# Altium schematic sheet Controlador de corriente  V3.SchDoc: Levitador magnético
size A4
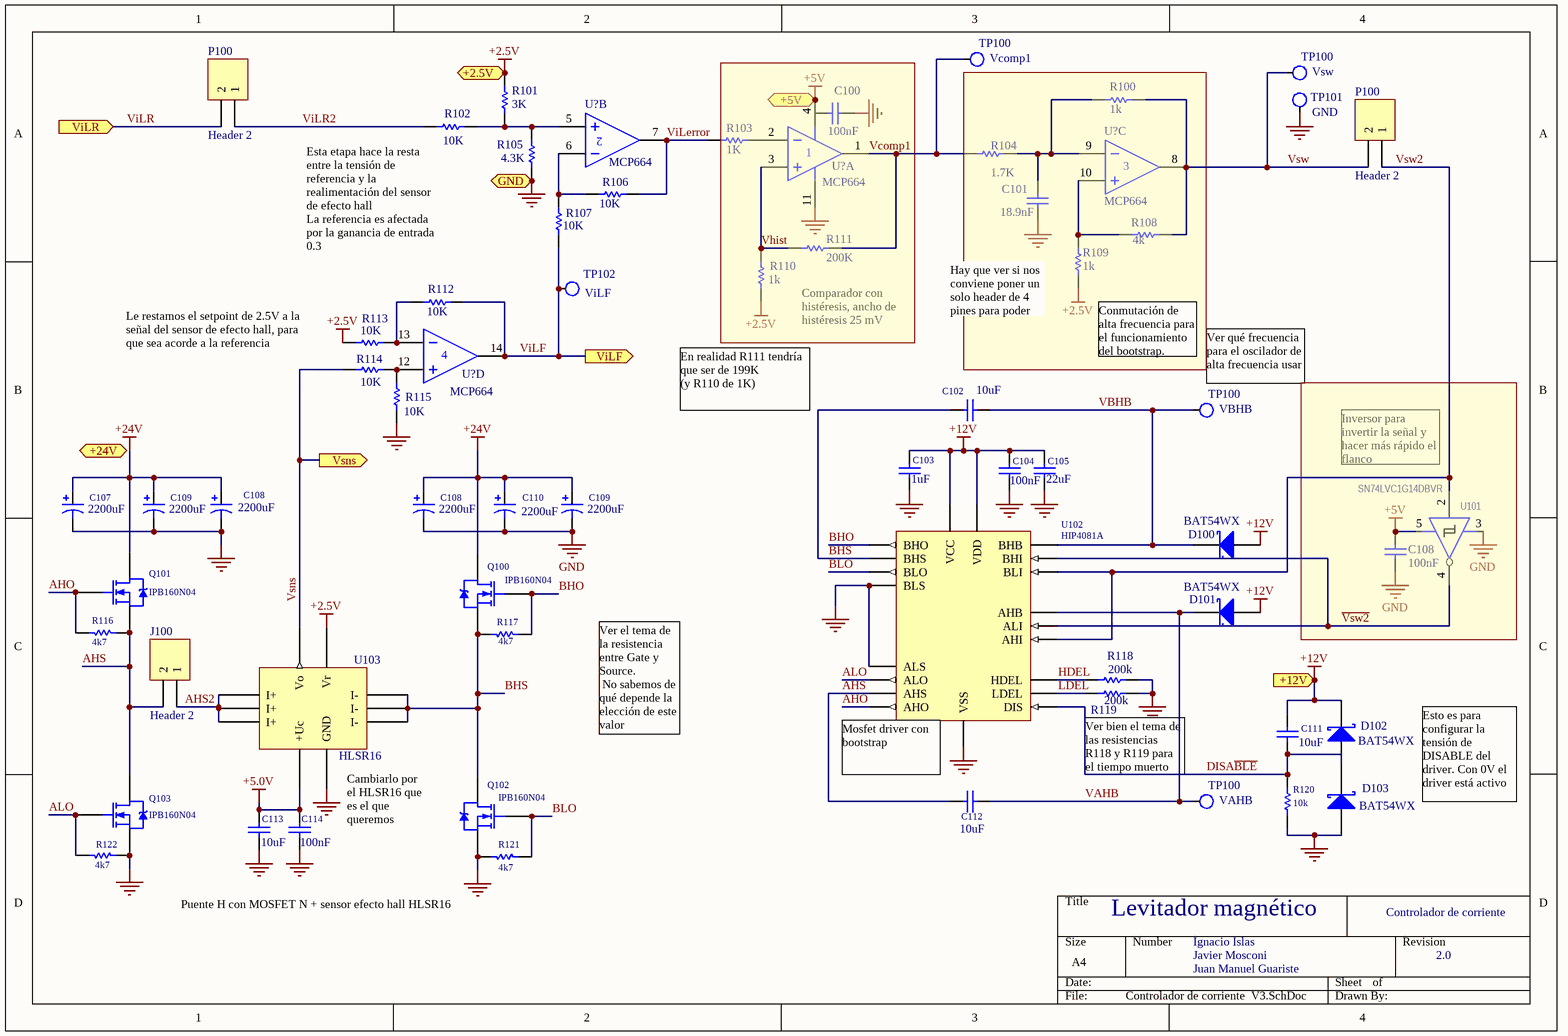
[diagram p0: Controlador de corriente  V3.SchDoc]

## Parts
(Parts that share a designator on the sheet are numbered #1, #2 ... from top to bottom, then left to right.)
C100  value 100nF  [C1206]  (hidden comment: Cap)
C101  value 18.9nF  [C1206]  (hidden comment: Cap)
C102  10uF  [C1206]
C103  1uF  [C1206]
C104  100nF  [C1206]
C105  22uF  [C1206]
C107  value 2200uF  [ALU CASE P]  (hidden comment: Cap Pol1)
C108#1  value 2200uF  [ALU CASE P]  (hidden comment: Cap Pol1)
C108#2  value 2200uF  [ALU CASE P]  (hidden comment: Cap Pol1)
C108#3  value 100nF  [C1206]  (hidden comment: Cap)
C109#1  value 2200uF  [ALU CASE P]  (hidden comment: Cap Pol1)
C109#2  value 2200uF  [ALU CASE P]  (hidden comment: Cap Pol1)
C110  value 2200uF  [ALU CASE P]  (hidden comment: Cap Pol1)
C111  10uF  [C1206]
C112  10uF  [C1206]
C113  10uF  [C1206]
C114  100nF  [C1206]
D100  BAT54WX  [SOD523]
D101  BAT54WX  [SOD523]
D102  BAT54WX  [SOD523]
D103  BAT54WX  [SOD523]
J100  Header 2  [SMKDS5-2-9.5]
P100#1  Header 2  [HDR1X2]
P100#2  Header 2  [HDR1X2]
Q100  IPB160N04  [TO263-7S]
Q101  IPB160N04  [TO263-7S]
Q102  IPB160N04  [TO263-7S]
Q103  IPB160N04  [TO263-7S]
R100  value 1k  [R 1206L]  (hidden comment: Res1)
R101  value 3K  [R 1206L]  (hidden comment: Res1)
R102  value 10K  [R 1206L]  (hidden comment: Res1)
R103  value 1K  [R 1206L]  (hidden comment: Res1)
R104  value 1.7K  [R 1206L]  (hidden comment: Res1)
R105  value 4.3K  [R 1206L]  (hidden comment: Res1)
R106  value 10K  [R 1206L]  (hidden comment: Res1)
R107  value 10K  [R 1206L]  (hidden comment: Res1)
R108  value 4k  [R 1206L]  (hidden comment: Res1)
R109  value 1k  [R 1206L]  (hidden comment: Res1)
R110  value 1k  [R 1206L]  (hidden comment: Res1)
R111  value 200K  [R 1206L]  (hidden comment: Res1)
R112  value 10K  [R 1206L]  (hidden comment: Res1)
R113  value 10K  [R 1206L]  (hidden comment: Res1)
R114  value 10K  [R 1206L]  (hidden comment: Res1)
R115  value 10K  [R 1206L]  (hidden comment: Res1)
R116  4k7  [R 1206L]
R117  4k7  [R 1206L]
R118  value 200k  [R 1206L]  (hidden comment: Res1)
R119  value 200k  [R 1206L]  (hidden comment: Res1)
R120  10k  [R 1206L]
R121  4k7  [R 1206L]
R122  4k7  [R 1206L]
TP100#1  Vcomp1  [TestPoint Keystone 5000 Silver-Red]
TP100#2  Vsw  [TestPoint Keystone 5000 Silver-Red]
TP100#3  VBHB  [TestPoint Keystone 5000 Silver-Red]
TP100#4  VAHB  [TestPoint Keystone 5000 Silver-Red]
TP101  GND  [TestPoint Keystone 5000 Silver-Red]
TP102  ViLF  [TestPoint Keystone 5000 Silver-Red]
U101  SN74LVC1G14DBVR  [SOT23-5]
U102  HIP4081A  [SOIC20]
U103  HLSR16  [HSLR-P]
U?#1  MCP664  (part B of 4)
U?#2  MCP664  (part A of 4)
U?#3  MCP664  (part C of 4)
U?#4  MCP664  (part D of 4)

## Ports
+2.5V (in), +5V (in), +12V (in), +24V (in), GND (in), ViLF (out), ViLR (in), Vsns (out)

## Nets
+2.5V: R101.2 R109.1 R110.1 R113.1 U103.1(Vr) ; port +2.5V
+5.0V: C113.2 C114.2 U103.4(+Uc)
+5V: C108#3.1 U101.5(V+) U?#2.4(V+) ; port +5V
+12V: C103.2 C104.2 C105.2 C111.1 D100.1(A) D101.1(A) D102.2(K) U102.15(VCC) U102.16(VDD) ; port +12V
+24V: C107.1 C108#1.1 C108#2.1 C109#1.1 C109#2.1 C110.1 Q100.4(D) Q101.4(D)
GND: C100.2 C101.1 C103.1 C104.1 C105.1 C107.2 C108#1.2 C108#2.2 C108#3.2 C109#1.2 C109#2.2 C110.2 C113.1 C114.1 D103.1(A) Q102.2(S) Q102.3(S) Q102.5(S) Q102.6(S) Q102.7(S) Q103.2(S) Q103.3(S) Q103.5(S) Q103.6(S) Q103.7(S) R105.2 R115.1 R118.2 R119.2 R120.2 R121.2 R122.1 TP101.1 U101.3(V-) U102.4(VSS) U102.14(ALS) U102.17(BLS) U103.3(GND) U?#2.11(V-) ; port GND
AHO: Q101.1(G) R116.2 U102.11(AHO)
AHS: C112.1 J100.2 Q101.2(S) Q101.3(S) Q101.5(S) Q101.6(S) Q101.7(S) Q103.4(D) R116.1 U102.12(AHS)
AHS2: J100.1 U103.8(I+) U103.9(I+) U103.10(I+)
ALO: Q103.1(G) R122.2 U102.13(ALO)
BHO: Q100.1(G) R117.1 U102.20(BHO)
BHS: C102.2 Q100.2(S) Q100.3(S) Q100.5(S) Q100.6(S) Q100.7(S) Q102.4(D) R117.2 U102.19(BHS) U103.5(I-) U103.6(I-) U103.7(I-)
BLO: Q102.1(G) R121.1 U102.18(BLO)
DISA~{BLE}: C111.2 R120.1 U102.3(DIS)
HDEL: R118.1 U102.8(HDEL)
LDEL: R119.1 U102.9(LDEL)
~{Vsw2}: U101.4(Y) U102.2(BHI) U102.6(ALI)
VAHB: C112.2 D101.2(K) TP100#4.1 U102.10(AHB)
VBHB: C102.1 D100.2(K) TP100#3.1 U102.1(BHB)
Vcomp1: R104.1 R111.2 TP100#1.1 U?#2.1(OUT)
Vhist: R110.2 R111.1 U?#2.3(IN+)
ViLerror: R103.1 R106.2 U?#1.7(OUT)
ViLF: R107.1 R112.2 TP102.1 U?#4.14(OUT) ; port ViLF
ViLR: P100#1.2 ; port ViLR
ViLR2: P100#1.1 R102.1
Vsns: R114.1 U103.2(Vo) ; port Vsns
Vsw: P100#2.2 R100.2 R108.2 TP100#2.1 U?#3.8(OUT)
Vsw2: P100#2.1 U101.2(A) U102.5(BLI) U102.7(AHI)
NetC101_2: C101.2 R100.1 R104.2 U?#3.9(IN-)
NetD102_1: D102.1(A) D103.2(K)
NetR101_1: R101.1 R102.2 R105.1 U?#1.5(IN+)
NetR103_2: R103.2 U?#2.2(IN-)
NetR106_1: R106.1 R107.2 U?#1.6(IN-)
NetR108_1: R108.1 R109.2 U?#3.10(IN+)
NetR112_1: R112.1 R113.2 U?#4.13(IN-)
NetR114_2: R114.2 R115.2 U?#4.12(IN+)

Not connected (* = marked no-connect by the designer): C100 1

## Notes on the sheet
- (near R102) Esta etapa hace la resta entre la tensión de referencia y la realimentación del sensor de efecto hall
  La referencia es afectada por la ganancia de entrada 0.3
- Hay que ver si nos conviene poner un solo header de 4 pines para poder puentear el oscilador de alta frecuencia
- Le restamos el setpoint de 2.5V a la señal del sensor de efecto hall, para que sea acorde a la referencia
- Comparador con histéresis, ancho de histéresis 25 mV
- Conmutación de alta frecuencia para el funcionamiento del bootstrap.
  Frecuencia a determinar >= 20 kHz (ponele)
- (near TP100#3) Ver qué frecuencia para el oscilador de alta frecuencia usar
- En realidad R111 tendría que ser de 199K
  (y R110 de 1K)
- Inversor para invertir la señal y hacer más rápido el flanco
- Ver el tema de la resistencia entre Gate y Source.
  No sabemos de qué depende la elección de este valor
- (near U102) Mosfet driver con bootstrap
- Ver bien el tema de las resistencias R118 y R119 para el tiempo muerto
- Esto es para configurar la tensión de DISABLE del driver. Con 0V el driver está activo
- Puente H con MOSFET N + sensor efecto hall HLSR16
- (near U103) Cambiarlo por el HLSR16 que es el que queremos
- Controlador de corriente
- Ignacio Islas
- Javier Mosconi
- Juan Manuel Guariste
- 2.0

## Library data of the parts
C100 C101 C108#3 = Cap: Capacitor; Published: 8-Jun-2000; LatestRevisionDate: 17-Jul-2002; LatestRevisionNote: Re-released for DXP Platform.; PackageReference: RAD-0.3; Publisher: Altium Limited; PackageDescription: Radial Cap, Thru-Hole; 2 Leads; 0.3 in Pin Spacing
C102-C105 C111-C114 = C1206: Capacitor Chip 1206; Dielectric: NP0; Voltage: 50V; Published: 8-Jun-2000; LatestRevisionDate: 26/08/2013; LatestRevisionNote: IPC-7351 Footprint Added.; PackageReference: 1206; Publisher: Altium Limited; PackageDescription: Chip Capacitor; Supplier 1: Digi-Key
  C102 C111-C113: Value: 10uF
  C103: Value: 1uF
  C104 C114: Value: 100nF
  C105: Value: 22uF
C107 C108#1 C108#2 C109#1 C109#2 C110 = Cap Pol1: Polarized Capacitor (Radial); ESR: 0.028 ohm; Published: 8-Jun-2000; LatestRevisionDate: 17-Jul-2002; LatestRevisionNote: Re-released for DXP Platform.; PackageReference: RB7.6-15; Publisher: Altium Limited
D100-D103 = Diode 10TQ035: Schottky Rectifier; Note: Terminal 2 is the TAB and is electrically connected to the cathode; Published: 8-Jun-2000; LatestRevisionDate: 17-Jul-2002; LatestRevisionNote: Re-released for DXP Platform.; DatasheetDocument: PD-2.057B; PackageDocument: Feb-1998; PackageReference: TO-220AC; Publisher: Altium Limited; ComponentLink1Description: Manufacturer Link; ComponentLink1URL: http://www.irf.com/; ComponentLink2Description: Datasheet; ComponentLink2URL: http://www.irf.com/product-info/datasheets/data/10tq.pdf
J100 P100#1 P100#2 = Header 2: Header, 2-Pin; LatestRevisionDate: 17-Jul-2002; LatestRevisionNote: Re-released for DXP Platform.; Publisher: Altium Limited
Q100-Q103 = IRF630S: HEXFET N-Channel Power MOSFET; Published: 8-Jun-2000; LatestRevisionDate: 17-Jul-2002; LatestRevisionNote: Re-released for DXP Platform.; DatasheetVersion: PD-9.901; PackageReference: PG-TO263-7-3; Publisher: Altium Limited; PackageDescription: D2-PAK/TO-263-AB; 3 Leads (1 Cropped); Body 15.5 (inc. leads) x 10.5 mm (LxW max); ComponentLink1Description: Manufacturer Link; ComponentLink1URL: http://www.irf.com/; ComponentLink2Description: Datasheet; ComponentLink2URL: http://www.irf.com/product-info/datasheets/data/irf630s.pdf
R100-R115 R118 R119 = Res1: Resistor; Published: 8-Jun-2000; LatestRevisionDate: 17-Jul-2002; LatestRevisionNote: Re-released for DXP Platform.; PackageReference: AXIAL-0.3; Publisher: Altium Limited; PackageDescription: Axial Device, Thru-Hole; 2 Leads; 0.3 in Pin Spacing
R116 R117 R120-R122 = R1206: Resistor Chip; 1/8W;; Published: 8-Jun-2000; LatestRevisionDate: 26/8/2013; PackageReference: 1206; Publisher: Altium Limited; PackageDescription: SMT Chip Resistor; Supplier 1: Digi-Key
  R116 R117 R121 R122: Value: 4k7
  R120: Value: 10k
TP100#1-TP100#4 TP101 TP102 = Tespoint: Test point
U101 = SN74LVC1G14DBVR: Schmitt-Trigger Inverter; Published: 8-Jun-2000; LatestRevisionDate: 13-Apr-2006; LatestRevisionNote: IPC-7351 Footprint Added.; DatasheetVersion: Jul-1998; PackageVersion: Jan-1998; PackageReference: D014; Publisher: Altium Limited; PackageDescription: 14-Pin Small Outline Integrated Circuit 1.27 mm Pitch; Code_IPC: SOIC127P600-14; ComponentLink1Description: Manufacturer Link; ComponentLink1URL: http://www.ti.com/; ComponentLink2Description: Datasheet; ComponentLink2URL: http://www-s.ti.com/sc/ds/sn74ahc14.pdf; ComponentLink3Description: Packaging Specification; ComponentLink3URL: http://focus.ti.com/lit/ml/mpds177/mpds177.pdf
U102 = HIP4081A: INTERSIL, 80V, 2.5A peak, High Frequency Full Bridge FET Driver
U103 = HSLR32: Hall Effect Current Sensor
U?#1-U?#4 = MCP664: Datasheet: https://ar.mouser.com/datasheet/2/268/22194B-77503.pdf